# Altium project CRD25DA12N-FMC V1-2 (01-2024).PrjPcb (part 4 of 8)
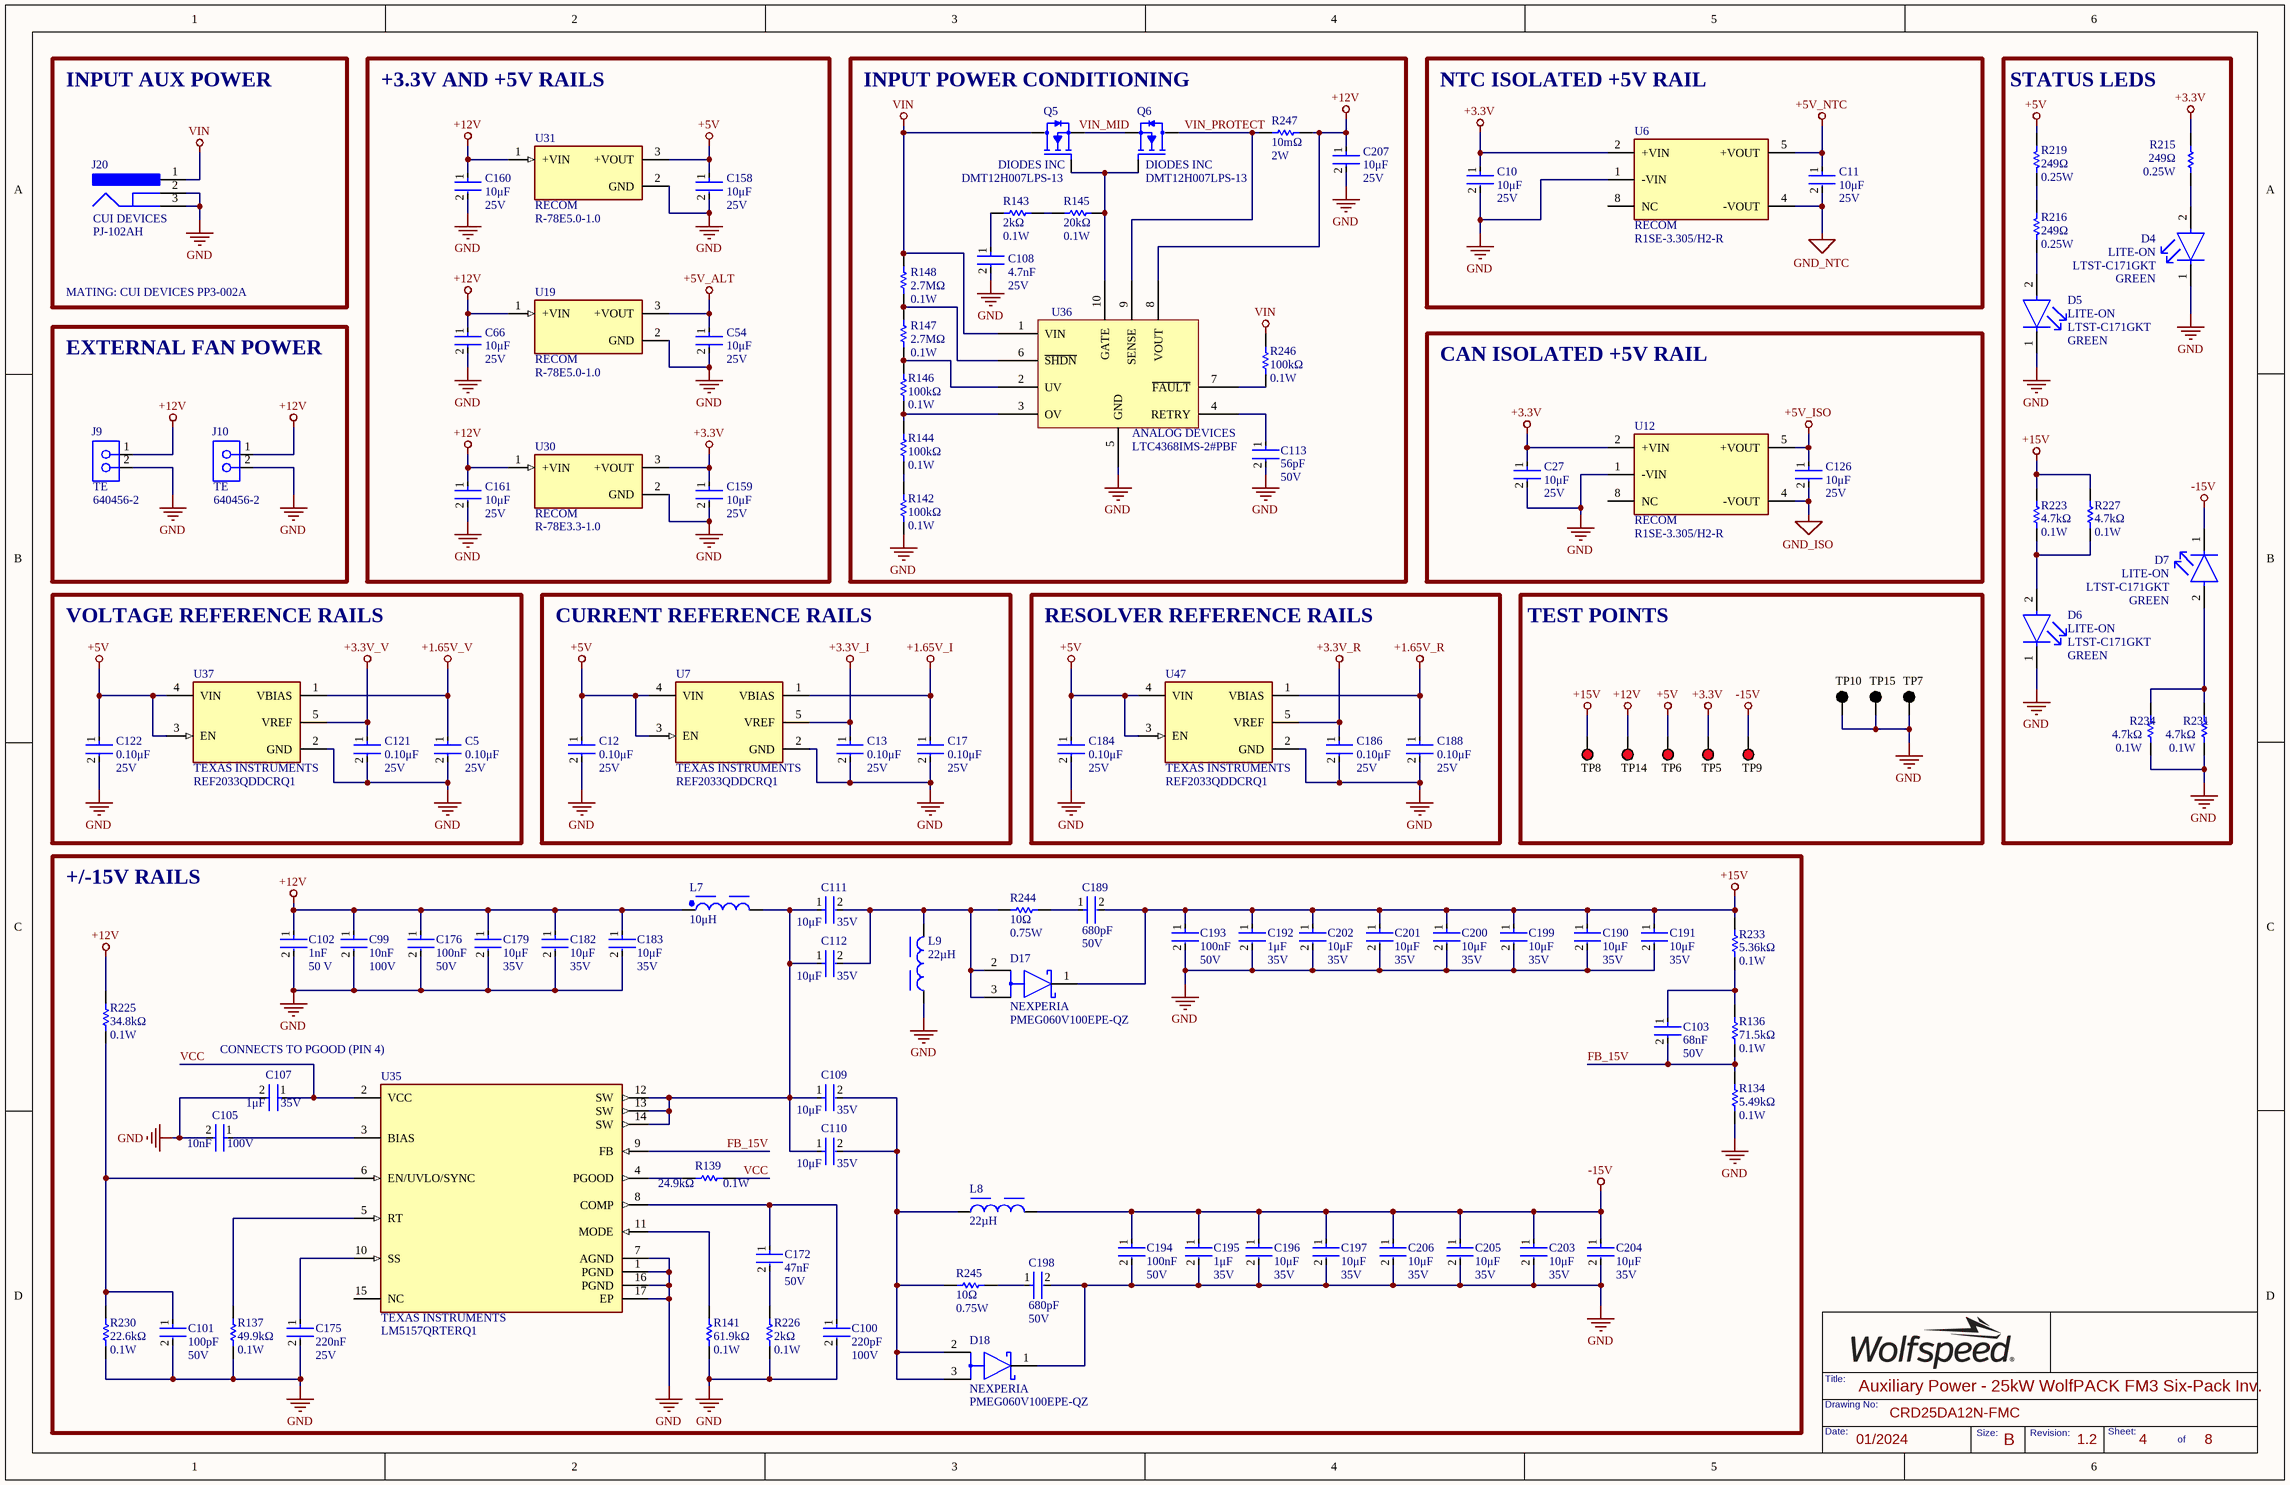
[diagram p9: 04 - Auxiliary Power.SchDoc]

## Sheet 04 - Auxiliary Power.SchDoc: Auxiliary Power - 25kW WolfPACK FM3 Six-Pack Inv. (continued)

### Library data of the parts (continued)
R233 = RT0603BRD075K36L: RES SMD 5.36KOHM 0.1% 1/10W 0603; Manufacturer: YAGEO; Temperature Coefficient: 25ppm/°C; Max Power Dissipation: 100mW; Voltage Rating: 75V; Voltage Rating (DC): 50V; Supplier 1: Digikey; Manufacturer Part Number: RT0603BRD075K36L; RoHS: Yes; Category: Chip SMD Resistors; Stock 1: 5772; Pricing 1: 1=0.13, 10=0.097, 50=0.0768, 100=0.0689, 500=0.05248, 1000=0.04637 (USD); Case/Package: 0603; Case Code (Metric): 1608; Case Code (Imperial): 0603; Min Operating Temperature: -55°C; Max Operating Temperature: 155°C; Resistance: 5.36kΩ; Tolerance: 0.1%; Packaging: Tape and Reel; Series: RT; Number of Terminations: 2; Termination: SMD/SMT; Package Quantity: 5000; Features: Moisture Resistant; Length: 0.063inch; Width: 0.031inch; Height: 0.022inch; RoHS Compliant: Yes; Lead Free: Lead Free; ComponentLink1URL: https://datasheet.ciiva.com/12706/pyu-rt-1-to-0-05-rohs-l-4-12706234.pdf?src-supplier=Mouser; ComponentLink1Description: https://datasheet.ciiva.com/12706/pyu-rt-1-to-0-05-rohs-l-4-12706234.pdf?src-supplier=Mouser; ComponentLink2URL: https://datasheet.ciiva.com/46635/pyu-rt-1-to-0-05-rohs-l-5-46635294.pdf?src-supplier=Digikey; ComponentLink2Description: https://datasheet.ciiva.com/46635/pyu-rt-1-to-0-05-rohs-l-5-46635294.pdf?src-supplier=Digikey; ComponentLink3URL: https://datasheet.ciiva.com/2586/pyu-rt-1-to-0-05-rohs-l-4-2586015.pdf?src-supplier=Digikey; ComponentLink3Description: https://datasheet.ciiva.com/2586/pyu-rt-1-to-0-05-rohs-l-4-2586015.pdf?src-supplier=Digikey; Supplier Part Number 1: YAG1697CT-ND; Package: 0603
R244 R245 = CRCW121010R0FKEAHP: RES SMD 10 OHM 1% 3/4W 1210; Manufacturer: VISHAY; Voltage Rating: 200V; Max Power Dissipation: 750mW; Temperature Coefficient: 100ppm/°C; Supplier 1: Mouser; Manufacturer Part Number: CRCW121010R0FKEAHP; RoHS: Yes; Category: Chip SMD Resistors; Stock 1: 37298; Pricing 1: 1=0.62, 10=0.237, 50=0.237, 100=0.203, 500=0.15, 1000=0.133, 5000=0.104, 10000=0.103, 50000=0.09 (USD); Case/Package: 1210; Weight: 0.000564oz; Case Code (Metric): 3225; Case Code (Imperial): 1210; Contact Plating: Tin; Min Operating Temperature: -55°C; Max Operating Temperature: 155°C; Packaging: Tape and Reel; Package Quantity: 10; Resistance: 10Ω; Tolerance: 1%; Number of Terminations: 2; Termination: SMD/SMT; Features: Automotive AEC-Q200; Series: CRCW-HP; Construction: Rectangular; Voltage Rating (DC): 200V; Length: 3.2mm; Width: 0.098inch; Height: 0.028inch; Depth: 2.5mm; Ratings: AEC-Q200; Military Standard: Not; Lead Free: Lead Free; RoHS Compliant: Yes; ComponentLink1URL: https://datasheet.ciiva.com/2478/crcwhpe3-2478099.pdf?src-supplier=Digikey; ComponentLink1Description: https://datasheet.ciiva.com/2478/crcwhpe3-2478099.pdf?src-supplier=Digikey; ComponentLink2URL: https://datasheet.ciiva.com/2478/crcwhpe3-2478100.pdf?src-supplier=Digikey; ComponentLink2Description: https://datasheet.ciiva.com/2478/crcwhpe3-2478100.pdf?src-supplier=Digikey; ComponentLink3URL: https://datasheet.ciiva.com/2478/crcwhpe3-2478101.pdf?src-supplier=Digikey; ComponentLink3Description: https://datasheet.ciiva.com/2478/crcwhpe3-2478101.pdf?src-supplier=Digikey; ComponentLink4URL: https://datasheet.ciiva.com/5544/crcwhpe3-46056-5544330.pdf?src-supplier=Mouser; ComponentLink4Description: https://datasheet.ciiva.com/5544/crcwhpe3-46056-5544330.pdf?src-supplier=Mouser; Supplier Part Number 1: 71-CRCW121010R0FKEAH; Package: 1210
R247 = PE2512FKE7W0R01L: RES 0.01 OHM 1% 2W 2512; Manufacturer: YAGEO; Temperature Coefficient: 50ppm/°C; Value: 10mΩ; Supplier 1: Rs; Manufacturer Part Number: PE2512FKE7W0R01L; RoHS: Yes; Category: Chip SMD Resistors; Stock 1: 2110; Package: 2512; Case Code (Metric): 6432; Case Code (Imperial): 2512; Min Operating Temperature: -55°C; Max Operating Temperature: 170°C; Packaging: Tape and Reel; Resistor Type: Metal Film; Number of Terminations: 2; Tolerance: 1%; Features: Moisture Resistant,Automotive AEC-Q200; Length: 0.248inch; Width: 0.122inch; Height: 0.03inch; Lead Free: Lead Free; ComponentLink1URL: http://www.mouser.com/ds/2/447/PYu-PE_521_RoHS_L_1-536447.pdf?src-supplier=Mouser; ComponentLink1Description: http://www.mouser.com/ds/2/447/PYu-PE_521_RoHS_L_1-536447.pdf?src-supplier=Mouser; ComponentLink2URL: http://www.yageo.com/NewPortal/yageodocoutput?fileName=/pdf/R-Chip/PYu-PE_521_RoHS_L_5.pdf&src-supplier=Digi-Key; ComponentLink2Description: http://www.yageo.com/NewPortal/yageodocoutput?fileName=/pdf/R-Chip/PYu-PE_521_RoHS_L_5.pdf&src-supplier=Digi-Key; Supplier Part Number 1: 1995902P
TP5 TP6 TP8 TP9 TP14 = CMP-1672-00002-4: PC TEST POINT MULTIPURPOSE RED; Manufacturer: KEYSTONE; Contact Material: Bronze; Mounting Technology: Through Hole; RoHSCompliant: true; Pins: 1; Package Quantity: 100; ComponentLink2Description: Datasheet; Height: 8.12 mm; ComponentLink1URL: http://www.keyelco.com/; DatasheetVersion: Rev. F, 12/2013; Mount: Through Hole; PackageReference: 5010; Contact Plating: Silver; Packaging: Bulk; Colour: Red; REACH SVHC: No SVHC; PackageDescription: 1-Pin Through Hole Device, Dia 3.17 mm; ComponentLink2URL: http://www.keyelco.com/product-pdf.cfm?p=1319; ComponentLink1Description: Manufacturer URL; Manufacturer Part Number: 5010; Value: RED; Package: N/A
TP7 TP10 TP15 = CMP-1672-00003-4: PC TEST POINT MULTIPURPOSE BLACK; Manufacturer: KEYSTONE; ComponentLink2URL: http://www.keyelco.com/product-pdf.cfm?p=1320; Colour: Black; Pins: 1; REACH SVHC: No SVHC; ComponentLink1URL: http://www.keyelco.com/; PackageReference: 5011; Contact Plating: Silver; Package Quantity: 100; Packaging: Bulk; RoHSCompliant: true; Height: 8.12 mm; PackageDescription: 1-Pin Through Hole Device, Dia 3.17 mm; Mount: Through Hole; Mounting Technology: Through Hole; DatasheetVersion: Rev. F, 12/2013; ComponentLink1Description: Manufacturer URL; Contact Material: Bronze; ComponentLink2Description: Datasheet; Manufacturer Part Number: 5011; Value: BLACK; Package: N/A
U6 U12 = R1SE-3.305/H2-R: DC DC CONVERTER 5V 1W; Number of Outputs: 1; Min Input Voltage: 2.97V; Max Input Voltage: 3.63V; Max Output Current: 200mA; Isolation Voltage: 2kV; Efficiency: 75%; Supplier 1: Digi-Key; RoHS: Yes; Category: Board Mount Modules; Stock 1: 563; Pricing 1: 1=4.51000, 5=4.44600, 10=4.38300, 25=4.25800, 50=4.00760, 100=3.88240, 250=3.75720 (USD); Mount: Surface Mount; Case/Package: SMD/SMT; Weight: 1g; Min Operating Temperature: -40°C; Max Operating Temperature: 100°C; Packaging: Cut Tape; Voltage - Output 1: 5V; Min Input Voltage (DC): 2.97V; Max Input Voltage (DC): 3.63V; Max Output Power: 1W; Current - Output 1: 200mA; Max Power Dissipation: 1W; Max Output Voltage: 5V; Series: ECONOLINE R1SE-H2 (1W); Length: 12.75mm; Width: 10.7mm; Height: 6.7mm; Depth: 12.75mm; Reach SVHC Compliant: Yes; Lead Free: Lead Free; RoHS Compliant: Yes; ComponentLink1URL: http://www.farnell.com/datasheets/1905443.pdf?src-supplier=Farnell; ComponentLink1Description: http://www.farnell.com/datasheets/1905443.pdf?src-supplier=Farnell; ComponentLink2URL: http://www.alliedelec.com/images/products/datasheets/bm/1_Datasheets/70595177.pdf?src-supplier=Allied+Electronics; ComponentLink2Description: http://www.alliedelec.com/images/products/datasheets/bm/1_Datasheets/70595177.pdf?src-supplier=Allied+Electronics; ComponentLink3URL: https://www.recom-power.com/pdf/Econoline/R1SE_H2.pdf?src-supplier=Digi-Key; ComponentLink3Description: https://www.recom-power.com/pdf/Econoline/R1SE_H2.pdf?src-supplier=Digi-Key; ComponentLink4URL: http://www.farnell.com/datasheets/1905443.pdf?src-supplier=Element14; ComponentLink4Description: http://www.farnell.com/datasheets/1905443.pdf?src-supplier=Element14; Supplier Part Number 1: 945-R1SE-3.305/H2-RCT-ND; Value: N/A; Package: 8-SMD; Manufacturer Part Number: R1SE-3.305/H2-R
U7 U37 U47 = REF2033QDDCRQ1: AUTOMOTIVE LOW-DRIFT, LOW-POWER,; Supplier 1: Mouser; Manufacturer Part Number: REF2033QDDCRQ1; RoHS: No; Category: Voltage References; Stock 1: 7420; Pricing 1: 1=3.59, 10=3.23, 50=3.23, 100=2.65, 1000=2.02, 10000=1.7 (USD); Supplier Part Number 1: 595-REF2033QDDCRQ1; Package: TSOT-23-5; Value: N/A
U19 U31 = R-78E5.0-1.0: DC DC CONVERTER 5V 5W; Number of Outputs: 1; Min Input Voltage: 8V; Max Input Voltage: 28V; Max Output Current: 1A; Efficiency: 91%; Supplier 1: Rs; Manufacturer: RECOM; Manufacturer Part Number: R-78E5.0-1.0; RoHS: Yes; Category: Voltage Regulators - Switching; Stock 1: 661; Mount: Through Hole; Case/Package: SIP; Weight: 2g; Min Operating Temperature: -40°C; Max Operating Temperature: 85°C; Packaging: Rail/Tube; Voltage - Output 1: 5V; Max Power Dissipation: 5W; Output Power: 5W; Current - Output 1: 1A; Package Quantity: 42; Max Output Voltage: 5V; Features: SCP; Length: 11.6mm; Width: 8.5mm; Height: 10.4mm; Lead Free: Lead Free; RoHS Compliant: Yes; ComponentLink1URL: http://www.farnell.com/datasheets/2787646.pdf?src-supplier=Farnell; ComponentLink1Description: http://www.farnell.com/datasheets/2787646.pdf?src-supplier=Farnell; ComponentLink2URL: http://www.mouser.com/ds/2/468/R-78Exx-1.0-958279.pdf?src-supplier=Mouser; ComponentLink2Description: http://www.mouser.com/ds/2/468/R-78Exx-1.0-958279.pdf?src-supplier=Mouser; ComponentLink3URL: https://www.recom-power.com/pdf/Innoline/R-78Exx-1.0.pdf?src-supplier=Digi-Key; ComponentLink3Description: https://www.recom-power.com/pdf/Innoline/R-78Exx-1.0.pdf?src-supplier=Digi-Key; ComponentLink4URL: http://www.farnell.com/datasheets/1848475.pdf?src-supplier=Newark; ComponentLink4Description: http://www.farnell.com/datasheets/1848475.pdf?src-supplier=Newark; ComponentLink5URL: http://www.farnell.com/datasheets/2787646.pdf?src-supplier=Element14; ComponentLink5Description: http://www.farnell.com/datasheets/2787646.pdf?src-supplier=Element14; ComponentLink6URL: http://datasheet.octopart.com/R-78E5.0-1.0-Recom-Power-datasheet-68298118.pdf?src-supplier=Rs; ComponentLink6Description: http://datasheet.octopart.com/R-78E5.0-1.0-Recom-Power-datasheet-68298118.pdf?src-supplier=Rs; Supplier Part Number 1: 1446013; Package: 3-SIP; Value: N/A
U30 = R-78E3.3-1.0: DC DC CONVERTER 3.3V 3W; Number of Outputs: 1; Min Input Voltage: 8V; Max Input Voltage: 28V; Max Output Current: 1A; Efficiency: 91%; Max Output Power: 3.3W; Min Input Voltage (DC): 7V; Supplier 1: Rs; Manufacturer: RECOM; Manufacturer Part Number: R-78E3.3-1.0; RoHS: Yes; Category: Board Mount Modules; Stock 1: 1; Pricing 1: 1=3.93700, 5=3.82200, 10=3.69700, 25=3.58300, 50=3.46900 (USD); Mount: Through Hole; Case/Package: SIP; Weight: 2g; Min Operating Temperature: -40°C; Max Operating Temperature: 85°C; Packaging: Rail/Tube; Voltage - Output 1: 3.3V; Nominal Output Voltage: 3.3V; Max Input Voltage (DC): 28V; Max Power Dissipation: 3W; Max Output Voltage: 3.3V; Features: SCP; Series: INNOLINE R-78E; Length: 11.6mm; Width: 8.5mm; Height: 10.4mm; Reach SVHC Compliant: Yes; Lead Free: Lead Free; RoHS Compliant: Yes; ComponentLink1URL: http://www.farnell.com/datasheets/2787646.pdf?src-supplier=Farnell; ComponentLink1Description: http://www.farnell.com/datasheets/2787646.pdf?src-supplier=Farnell; ComponentLink2URL: https://www.recom-power.com/pdf/Innoline/R-78Exx-1.0.pdf?src-supplier=Digi-Key; ComponentLink2Description: https://www.recom-power.com/pdf/Innoline/R-78Exx-1.0.pdf?src-supplier=Digi-Key; ComponentLink3URL: http://www.farnell.com/datasheets/1965125.pdf?src-supplier=Element14; ComponentLink3Description: http://www.farnell.com/datasheets/1965125.pdf?src-supplier=Element14; ComponentLink4URL: http://www.farnell.com/datasheets/2787646.pdf?src-supplier=Newark; ComponentLink4Description: http://www.farnell.com/datasheets/2787646.pdf?src-supplier=Newark; Supplier Part Number 1: 9176626; Package: 3-SIP; Value: N/A
U35 = LM5157QRTERQ1: IC REG MULT CONFG ADJ 6.5A 16QFN; Supplier 1: Mouser; RoHS: No; Category: Voltage Regulators - Switching; Stock 1: 10233; Pricing 1: 1=4.45, 10=3.79, 50=3.79, 100=3.28, 250=3.11, 500=2.79, 1000=2.36, 3000=2.29, 10000=2.29 (USD); RoHS Compliant: Yes; Case/Package: 16-WFQFN; Value: N/A; Supplier Part Number 1: 595-LM5157QRTERQ1; Manufacturer Part Number: LM5157QRTERQ1; Package: 16-WFQFN
U36 = LTC4368IMS-2#PBF: IC SURGE SUPPRESSION ADJ 10MSOP; Supplier 1: Digi-Key; Manufacturer: ANALOG DEVICES; Manufacturer Part Number: LTC4368IMS-2#PBF; RoHS: Yes; Category: Power Management ICs; Pricing 1: 1=6.69000, 10=6.03900, 25=5.75840, 100=5.00000, 250=4.77528, 500=4.35396, 1000=3.97500 (USD); ComponentLink1URL: http://www.linear.com/docs/57622?src-supplier=Digi-Key; ComponentLink1Description: http://www.linear.com/docs/57622?src-supplier=Digi-Key; Supplier Part Number 1: 505-LTC4368IMS-2#PBF-ND; Package: 10-MSOP; Value: N/A

## Sheet 05 - Gate Drivers.SchDoc: Gate Drivers - 25kW WolfPACK FM3 Six-Pack Inv.
size 431 x 279 mm; Date: 01/2024; DocumentNumber: CRD25DA12N-FMC; Revision: 1.2; SheetNumber: 5; SheetTotal: 8; SheetSize: B
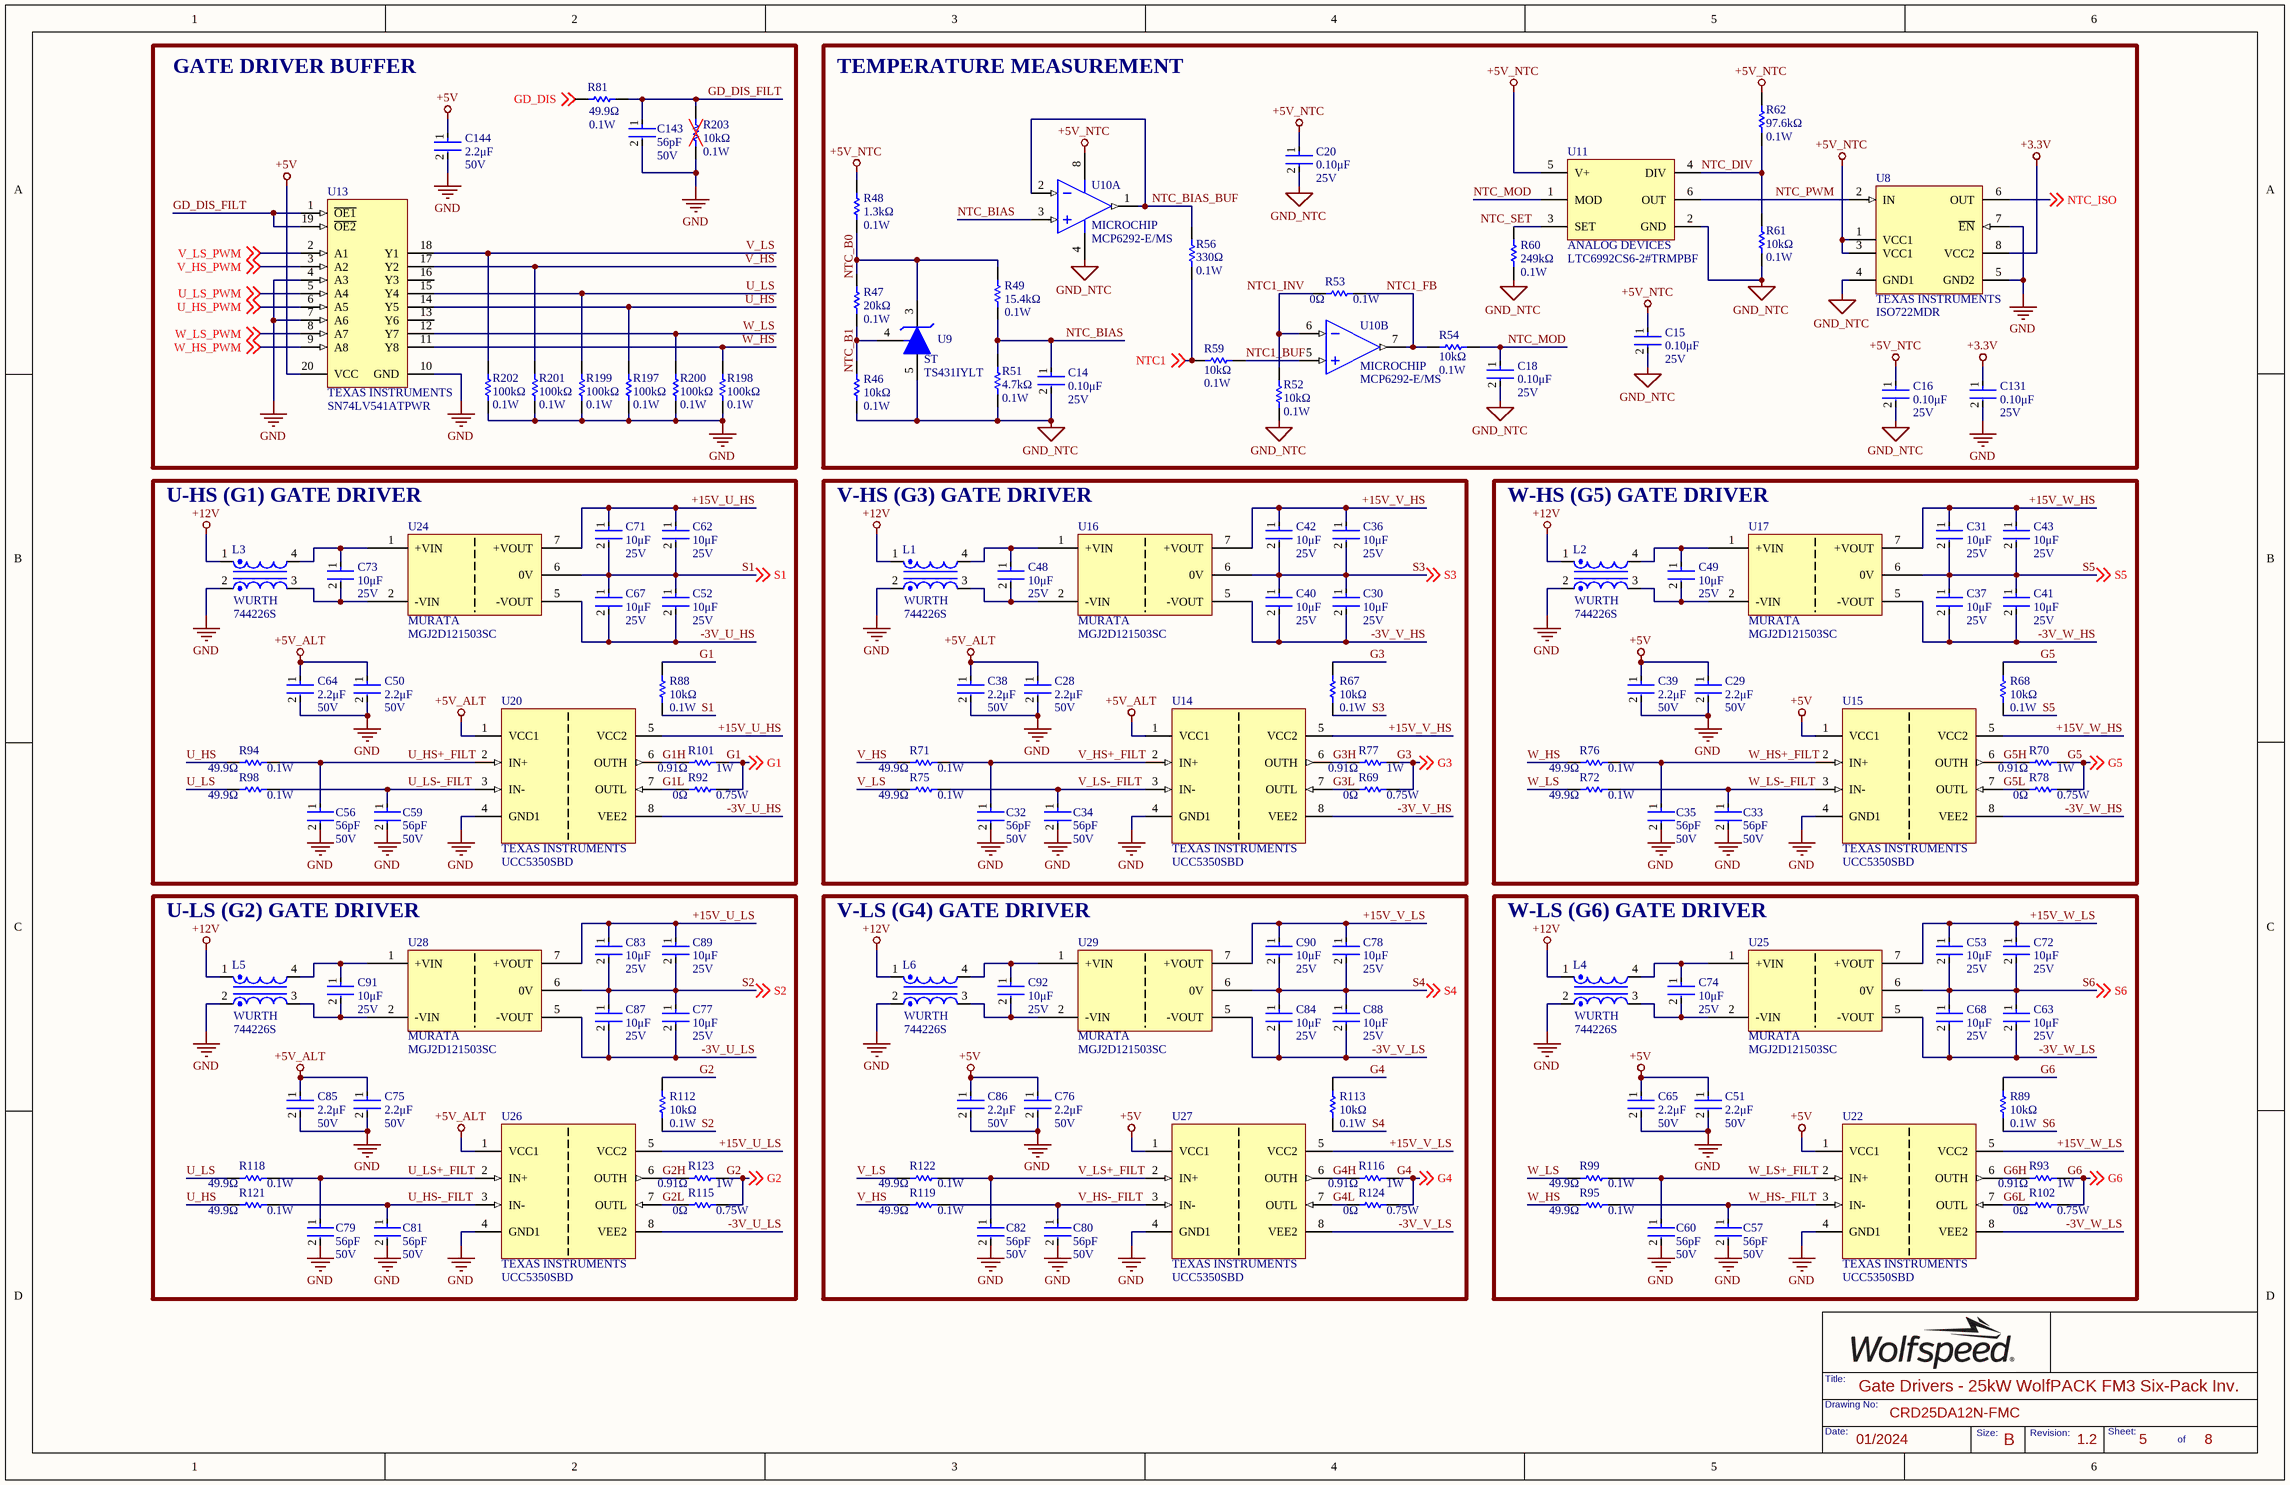
[diagram p4: 05 - Gate Drivers.SchDoc]

### Parts
C14  Voltage Rating: 25V  Capacitance: 0.10μF  [FP-C0603C-CF-IPC_B]  (hidden comment: C0603C104K3RACTU)
C15  Voltage Rating: 25V  Capacitance: 0.10μF  [FP-C0603C-CF-IPC_B]  (hidden comment: C0603C104K3RACTU)
C16  Voltage Rating: 25V  Capacitance: 0.10μF  [FP-C0603C-CF-IPC_B]  (hidden comment: C0603C104K3RACTU)
C18  Voltage Rating: 25V  Capacitance: 0.10μF  [FP-C0603C-CF-IPC_B]  (hidden comment: C0603C104K3RACTU)
C20  Voltage Rating: 25V  Capacitance: 0.10μF  [FP-C0603C-CF-IPC_B]  (hidden comment: C0603C104K3RACTU)
C28  Voltage Rating: 50V  Capacitance: 2.2μF  [FP-C0603C-CF-IPC_B]  (hidden comment: GRT188R61H225ME13D)
C29  Voltage Rating: 50V  Capacitance: 2.2μF  [FP-C0603C-CF-IPC_B]  (hidden comment: GRT188R61H225ME13D)
C30  Voltage Rating: 25V  Capacitance: 10μF  [FP-CL31-IPC_B]  (hidden comment: CL31B106KAHSFNE)
C31  Voltage Rating: 25V  Capacitance: 10μF  [FP-CL31-IPC_B]  (hidden comment: CL31B106KAHSFNE)
C32  Capacitance: 56pF  Voltage Rating: 50V  [FP-C0603C-CF-IPC_B]  (hidden comment: CL10C560JB8NNNC)
C33  Capacitance: 56pF  Voltage Rating: 50V  [FP-C0603C-CF-IPC_B]  (hidden comment: CL10C560JB8NNNC)
C34  Capacitance: 56pF  Voltage Rating: 50V  [FP-C0603C-CF-IPC_B]  (hidden comment: CL10C560JB8NNNC)
C35  Capacitance: 56pF  Voltage Rating: 50V  [FP-C0603C-CF-IPC_B]  (hidden comment: CL10C560JB8NNNC)
C36  Voltage Rating: 25V  Capacitance: 10μF  [FP-CL31-IPC_B]  (hidden comment: CL31B106KAHSFNE)
C37  Voltage Rating: 25V  Capacitance: 10μF  [FP-CL31-IPC_B]  (hidden comment: CL31B106KAHSFNE)
C38  Voltage Rating: 50V  Capacitance: 2.2μF  [FP-C0603C-CF-IPC_B]  (hidden comment: GRT188R61H225ME13D)
C39  Voltage Rating: 50V  Capacitance: 2.2μF  [FP-C0603C-CF-IPC_B]  (hidden comment: GRT188R61H225ME13D)
C40  Voltage Rating: 25V  Capacitance: 10μF  [FP-CL31-IPC_B]  (hidden comment: CL31B106KAHSFNE)
C41  Voltage Rating: 25V  Capacitance: 10μF  [FP-CL31-IPC_B]  (hidden comment: CL31B106KAHSFNE)
C42  Voltage Rating: 25V  Capacitance: 10μF  [FP-CL31-IPC_B]  (hidden comment: CL31B106KAHSFNE)
C43  Voltage Rating: 25V  Capacitance: 10μF  [FP-CL31-IPC_B]  (hidden comment: CL31B106KAHSFNE)
C48  Voltage Rating: 25V  Capacitance: 10μF  [FP-CL31-IPC_B]  (hidden comment: CL31B106KAHSFNE)
C49  Voltage Rating: 25V  Capacitance: 10μF  [FP-CL31-IPC_B]  (hidden comment: CL31B106KAHSFNE)
C50  Voltage Rating: 50V  Capacitance: 2.2μF  [FP-C0603C-CF-IPC_B]  (hidden comment: GRT188R61H225ME13D)
C51  Voltage Rating: 50V  Capacitance: 2.2μF  [FP-C0603C-CF-IPC_B]  (hidden comment: GRT188R61H225ME13D)
C52  Voltage Rating: 25V  Capacitance: 10μF  [FP-CL31-IPC_B]  (hidden comment: CL31B106KAHSFNE)
C53  Voltage Rating: 25V  Capacitance: 10μF  [FP-CL31-IPC_B]  (hidden comment: CL31B106KAHSFNE)
C56  Capacitance: 56pF  Voltage Rating: 50V  [FP-C0603C-CF-IPC_B]  (hidden comment: CL10C560JB8NNNC)
C57  Capacitance: 56pF  Voltage Rating: 50V  [FP-C0603C-CF-IPC_B]  (hidden comment: CL10C560JB8NNNC)
C59  Capacitance: 56pF  Voltage Rating: 50V  [FP-C0603C-CF-IPC_B]  (hidden comment: CL10C560JB8NNNC)
C60  Capacitance: 56pF  Voltage Rating: 50V  [FP-C0603C-CF-IPC_B]  (hidden comment: CL10C560JB8NNNC)
C62  Voltage Rating: 25V  Capacitance: 10μF  [FP-CL31-IPC_B]  (hidden comment: CL31B106KAHSFNE)
C63  Voltage Rating: 25V  Capacitance: 10μF  [FP-CL31-IPC_B]  (hidden comment: CL31B106KAHSFNE)
C64  Voltage Rating: 50V  Capacitance: 2.2μF  [FP-C0603C-CF-IPC_B]  (hidden comment: GRT188R61H225ME13D)
C65  Voltage Rating: 50V  Capacitance: 2.2μF  [FP-C0603C-CF-IPC_B]  (hidden comment: GRT188R61H225ME13D)
C67  Voltage Rating: 25V  Capacitance: 10μF  [FP-CL31-IPC_B]  (hidden comment: CL31B106KAHSFNE)
C68  Voltage Rating: 25V  Capacitance: 10μF  [FP-CL31-IPC_B]  (hidden comment: CL31B106KAHSFNE)
C71  Voltage Rating: 25V  Capacitance: 10μF  [FP-CL31-IPC_B]  (hidden comment: CL31B106KAHSFNE)
C72  Voltage Rating: 25V  Capacitance: 10μF  [FP-CL31-IPC_B]  (hidden comment: CL31B106KAHSFNE)
C73  Voltage Rating: 25V  Capacitance: 10μF  [FP-CL31-IPC_B]  (hidden comment: CL31B106KAHSFNE)
C74  Voltage Rating: 25V  Capacitance: 10μF  [FP-CL31-IPC_B]  (hidden comment: CL31B106KAHSFNE)
C75  Voltage Rating: 50V  Capacitance: 2.2μF  [FP-C0603C-CF-IPC_B]  (hidden comment: GRT188R61H225ME13D)
C76  Voltage Rating: 50V  Capacitance: 2.2μF  [FP-C0603C-CF-IPC_B]  (hidden comment: GRT188R61H225ME13D)
C77  Voltage Rating: 25V  Capacitance: 10μF  [FP-CL31-IPC_B]  (hidden comment: CL31B106KAHSFNE)
C78  Voltage Rating: 25V  Capacitance: 10μF  [FP-CL31-IPC_B]  (hidden comment: CL31B106KAHSFNE)
C79  Capacitance: 56pF  Voltage Rating: 50V  [FP-C0603C-CF-IPC_B]  (hidden comment: CL10C560JB8NNNC)
C80  Capacitance: 56pF  Voltage Rating: 50V  [FP-C0603C-CF-IPC_B]  (hidden comment: CL10C560JB8NNNC)
C81  Capacitance: 56pF  Voltage Rating: 50V  [FP-C0603C-CF-IPC_B]  (hidden comment: CL10C560JB8NNNC)
C82  Capacitance: 56pF  Voltage Rating: 50V  [FP-C0603C-CF-IPC_B]  (hidden comment: CL10C560JB8NNNC)
C83  Voltage Rating: 25V  Capacitance: 10μF  [FP-CL31-IPC_B]  (hidden comment: CL31B106KAHSFNE)
C84  Voltage Rating: 25V  Capacitance: 10μF  [FP-CL31-IPC_B]  (hidden comment: CL31B106KAHSFNE)
C85  Voltage Rating: 50V  Capacitance: 2.2μF  [FP-C0603C-CF-IPC_B]  (hidden comment: GRT188R61H225ME13D)
C86  Voltage Rating: 50V  Capacitance: 2.2μF  [FP-C0603C-CF-IPC_B]  (hidden comment: GRT188R61H225ME13D)
C87  Voltage Rating: 25V  Capacitance: 10μF  [FP-CL31-IPC_B]  (hidden comment: CL31B106KAHSFNE)
C88  Voltage Rating: 25V  Capacitance: 10μF  [FP-CL31-IPC_B]  (hidden comment: CL31B106KAHSFNE)
C89  Voltage Rating: 25V  Capacitance: 10μF  [FP-CL31-IPC_B]  (hidden comment: CL31B106KAHSFNE)
C90  Voltage Rating: 25V  Capacitance: 10μF  [FP-CL31-IPC_B]  (hidden comment: CL31B106KAHSFNE)
C91  Voltage Rating: 25V  Capacitance: 10μF  [FP-CL31-IPC_B]  (hidden comment: CL31B106KAHSFNE)
C92  Voltage Rating: 25V  Capacitance: 10μF  [FP-CL31-IPC_B]  (hidden comment: CL31B106KAHSFNE)
C131  Voltage Rating: 25V  Capacitance: 0.10μF  [FP-C0603C-CF-IPC_B]  (hidden comment: C0603C104K3RACTU)
C143  Capacitance: 56pF  Voltage Rating: 50V  [FP-C0603C-CF-IPC_B]  (hidden comment: CL10C560JB8NNNC)
C144  Voltage Rating: 50V  Capacitance: 2.2μF  [FP-C0603C-CF-IPC_B]  (hidden comment: GRT188R61H225ME13D)
L1  744226S  Manufacturer Print: WURTH  [WE-SL2]
L2  744226S  Manufacturer Print: WURTH  [WE-SL2]
L3  744226S  Manufacturer Print: WURTH  [WE-SL2]
L4  744226S  Manufacturer Print: WURTH  [WE-SL2]
L5  744226S  Manufacturer Print: WURTH  [WE-SL2]
L6  744226S  Manufacturer Print: WURTH  [WE-SL2]
R46  Resistance: 10kΩ  Max Power Dissipation: 0.1W  [FP-MCR03-IPC_B]  (hidden comment: ERJ3EKF1002V)
R47  Resistance: 20kΩ  Power Rating: 0.1W  [FP-MCR03-IPC_B]  (hidden comment: CRCW060320K0FKTA)
R48  Power Rating: 0.1W  Resistance: 1.3kΩ  [FP-MCR03-IPC_B]  (hidden comment: ERA3AEB132V)
R49  Power Rating: 0.1W  Resistance: 15.4kΩ  [FP-MCR03-IPC_B]  (hidden comment: RC1608F1542CS)
R51  Resistance: 4.7kΩ  Power Rating: 0.1W  [FP-MCR03-IPC_B]  (hidden comment: CRCW06034K70FKTA)
R52  Resistance: 10kΩ  Max Power Dissipation: 0.1W  [FP-MCR03-IPC_B]  (hidden comment: ERJ3EKF1002V)
R53  Resistance: 0Ω  Power Rating: 0.1W  [FP-MCR03-IPC_B]  (hidden comment: CRCW06030000Z0EB)
R54  Resistance: 10kΩ  Max Power Dissipation: 0.1W  [FP-MCR03-IPC_B]  (hidden comment: ERJ3EKF1002V)
R56  Resistance: 330Ω  Power Rating: 0.1W  [FP-MCR03-IPC_B]  (hidden comment: RC0603FR-13330RL)
R59  Resistance: 10kΩ  Max Power Dissipation: 0.1W  [FP-MCR03-IPC_B]  (hidden comment: ERJ3EKF1002V)
R60  Max Power Dissipation: 0.1W  Resistance: 249kΩ  [FP-MCR03-IPC_B]  (hidden comment: RMCF0603FT249K)
R61  Resistance: 10kΩ  Max Power Dissipation: 0.1W  [FP-MCR03-IPC_B]  (hidden comment: ERJ3EKF1002V)
R62  Resistance: 97.6kΩ  Max Power Dissipation: 0.1W  [FP-MCR03-IPC_B]  (hidden comment: ERJ-3EKF9762V)
R67  Resistance: 10kΩ  Max Power Dissipation: 0.1W  [FP-MCR03-IPC_B]  (hidden comment: ERJ3EKF1002V)
R68  Resistance: 10kΩ  Max Power Dissipation: 0.1W  [FP-MCR03-IPC_B]  (hidden comment: ERJ3EKF1002V)
R69  value 0Ω  Power Rating: 0.75W  [RESC3125X70X40NL20T20]  (hidden comment: CRCW12100000Z0EAHP)
R70  value 0.91Ω  Power: 1W  [RESC3125X70X40NL20T20]  (hidden comment: RCWE1210R910FKEA)
R71  Resistance: 49.9Ω  Power Rating: 0.1W  [FP-MCR03-IPC_B]  (hidden comment: ERJ-3EKF49R9V)
R72  Resistance: 49.9Ω  Power Rating: 0.1W  [FP-MCR03-IPC_B]  (hidden comment: ERJ-3EKF49R9V)
R75  Resistance: 49.9Ω  Power Rating: 0.1W  [FP-MCR03-IPC_B]  (hidden comment: ERJ-3EKF49R9V)
R76  Resistance: 49.9Ω  Power Rating: 0.1W  [FP-MCR03-IPC_B]  (hidden comment: ERJ-3EKF49R9V)
R77  value 0.91Ω  Power: 1W  [RESC3125X70X40NL20T20]  (hidden comment: RCWE1210R910FKEA)
R78  value 0Ω  Power Rating: 0.75W  [RESC3125X70X40NL20T20]  (hidden comment: CRCW12100000Z0EAHP)
R81  Resistance: 49.9Ω  Power Rating: 0.1W  [FP-MCR03-IPC_B]  (hidden comment: ERJ-3EKF49R9V)
R88  Resistance: 10kΩ  Max Power Dissipation: 0.1W  [FP-MCR03-IPC_B]  (hidden comment: ERJ3EKF1002V)
R89  Resistance: 10kΩ  Max Power Dissipation: 0.1W  [FP-MCR03-IPC_B]  (hidden comment: ERJ3EKF1002V)
R92  value 0Ω  Power Rating: 0.75W  [RESC3125X70X40NL20T20]  (hidden comment: CRCW12100000Z0EAHP)
R93  value 0.91Ω  Power: 1W  [RESC3125X70X40NL20T20]  (hidden comment: RCWE1210R910FKEA)
R94  Resistance: 49.9Ω  Power Rating: 0.1W  [FP-MCR03-IPC_B]  (hidden comment: ERJ-3EKF49R9V)
R95  Resistance: 49.9Ω  Power Rating: 0.1W  [FP-MCR03-IPC_B]  (hidden comment: ERJ-3EKF49R9V)
R98  Resistance: 49.9Ω  Power Rating: 0.1W  [FP-MCR03-IPC_B]  (hidden comment: ERJ-3EKF49R9V)
R99  Resistance: 49.9Ω  Power Rating: 0.1W  [FP-MCR03-IPC_B]  (hidden comment: ERJ-3EKF49R9V)
R101  value 0.91Ω  Power: 1W  [RESC3125X70X40NL20T20]  (hidden comment: RCWE1210R910FKEA)
R102  value 0Ω  Power Rating: 0.75W  [RESC3125X70X40NL20T20]  (hidden comment: CRCW12100000Z0EAHP)
R112  Resistance: 10kΩ  Max Power Dissipation: 0.1W  [FP-MCR03-IPC_B]  (hidden comment: ERJ3EKF1002V)
R113  Resistance: 10kΩ  Max Power Dissipation: 0.1W  [FP-MCR03-IPC_B]  (hidden comment: ERJ3EKF1002V)
R115  value 0Ω  Power Rating: 0.75W  [RESC3125X70X40NL20T20]  (hidden comment: CRCW12100000Z0EAHP)
R116  value 0.91Ω  Power: 1W  [RESC3125X70X40NL20T20]  (hidden comment: RCWE1210R910FKEA)
R118  Resistance: 49.9Ω  Power Rating: 0.1W  [FP-MCR03-IPC_B]  (hidden comment: ERJ-3EKF49R9V)
R119  Resistance: 49.9Ω  Power Rating: 0.1W  [FP-MCR03-IPC_B]  (hidden comment: ERJ-3EKF49R9V)
R121  Resistance: 49.9Ω  Power Rating: 0.1W  [FP-MCR03-IPC_B]  (hidden comment: ERJ-3EKF49R9V)
R122  Resistance: 49.9Ω  Power Rating: 0.1W  [FP-MCR03-IPC_B]  (hidden comment: ERJ-3EKF49R9V)
R123  value 0.91Ω  Power: 1W  [RESC3125X70X40NL20T20]  (hidden comment: RCWE1210R910FKEA)
R124  value 0Ω  Power Rating: 0.75W  [RESC3125X70X40NL20T20]  (hidden comment: CRCW12100000Z0EAHP)
R197  Resistance: 100kΩ  Power Rating: 0.1W  [FP-MCR03-IPC_B]  (hidden comment: RC0603FR-07100KL)
R198  Resistance: 100kΩ  Power Rating: 0.1W  [FP-MCR03-IPC_B]  (hidden comment: RC0603FR-07100KL)
R199  Resistance: 100kΩ  Power Rating: 0.1W  [FP-MCR03-IPC_B]  (hidden comment: RC0603FR-07100KL)
R200  Resistance: 100kΩ  Power Rating: 0.1W  [FP-MCR03-IPC_B]  (hidden comment: RC0603FR-07100KL)
R201  Resistance: 100kΩ  Power Rating: 0.1W  [FP-MCR03-IPC_B]  (hidden comment: RC0603FR-07100KL)
R202  Resistance: 100kΩ  Power Rating: 0.1W  [FP-MCR03-IPC_B]  (hidden comment: RC0603FR-07100KL)
R203  Resistance: 10kΩ  Max Power Dissipation: 0.1W  [FP-MCR03-IPC_B]  (hidden comment: ERJ3EKF1002V)
U8  ISO722MDR  Manufacturer: TEXAS INSTRUMENTS  [D0008B_L]
U9  TS431IYLT  Manufacturer Print: ST  [SOT95P280X145-5N]
U10  MCP6292-E/MS  Manufacturer Print: MICROCHIP  [MSOP-MS8_L]  (parts A,B of 2)
U11  LTC6992CS6-2#TRMPBF  MANUFACTURER PRINT: ANALOG DEVICES  [SOT95P280X100-6N]
U13  Manufacturer: TEXAS INSTRUMENTS  [PW0020A_L]  (hidden comment: SN74LV541ATPWR)
U14  UCC5350SBD  Manufacturer Print: TEXAS INSTRUMENTS  [D0008B_HV]
U15  UCC5350SBD  Manufacturer Print: TEXAS INSTRUMENTS  [D0008B_HV]
U16  MGJ2D121503SC  Manufacturer Print: MURATA  [MGJ2D121509SC]
U17  MGJ2D121503SC  Manufacturer Print: MURATA  [MGJ2D121509SC]
U20  UCC5350SBD  Manufacturer Print: TEXAS INSTRUMENTS  [D0008B_HV]
U22  UCC5350SBD  Manufacturer Print: TEXAS INSTRUMENTS  [D0008B_HV]
U24  MGJ2D121503SC  Manufacturer Print: MURATA  [MGJ2D121509SC]
U25  MGJ2D121503SC  Manufacturer Print: MURATA  [MGJ2D121509SC]
U26  UCC5350SBD  Manufacturer Print: TEXAS INSTRUMENTS  [D0008B_HV]
U27  UCC5350SBD  Manufacturer Print: TEXAS INSTRUMENTS  [D0008B_HV]
U28  MGJ2D121503SC  Manufacturer Print: MURATA  [MGJ2D121509SC]
U29  MGJ2D121503SC  Manufacturer Print: MURATA  [MGJ2D121509SC]

### Blocks framed on the sheet
GATE DRIVER BUFFER: C143 C144 R81 R197-R203 U13
TEMPERATURE MEASUREMENT: C14-C16 C18 C20 C131 R46-R49 R51-R54 R56 R59-R62 U8-U11
U-HS (G1) GATE DRIVER: C50 C52 C56 C59 C62 C64 C67 C71 C73 L3 R88 R92 R94 R98 R101 U20 U24
V-HS (G3) GATE DRIVER: C28 C30 C32 C34 C36 C38 C40 C42 C48 L1 R67 R69 R71 R75 R77 U14 U16
W-HS (G5) GATE DRIVER: C29 C31 C33 C35 C37 C39 C41 C43 C49 L2 R68 R70 R72 R76 R78 U15 U17
U-LS (G2) GATE DRIVER: C75 C77 C79 C81 C83 C85 C87 C89 C91 L5 R112 R115 R118 R121 R123 U26 U28
V-LS (G4) GATE DRIVER: C76 C78 C80 C82 C84 C86 C88 C90 C92 L6 R113 R116 R119 R122 R124 U27 U29
W-LS (G6) GATE DRIVER: C51 C53 C57 C60 C63 C65 C68 C72 C74 L4 R89 R93 R95 R99 R102 U22 U25

### Nets
+3.3V: C131.1 U8.8(VCC2)
+5V: C29.1 C39.1 C51.1 C65.1 C76.1 C86.1 C144.1 U13.20(VCC) U15.1(VCC1) U22.1(VCC1) U27.1(VCC1)
+5V_ALT: C28.1 C38.1 C50.1 C64.1 C75.1 C85.1 U14.1(VCC1) U20.1(VCC1) U26.1(VCC1)
+5V_NTC: C15.1 C16.1 C20.1 R48.2 R62.2 U8.1(VCC1) U8.3(VCC1) U10.8(VDD) U11.5(V+)
+12V: L1.1 L2.1 L3.1 L4.1 L5.1 L6.1
GND: C28.2 C29.2 C32.2 C33.2 C34.2 C35.2 C38.2 C39.2 C50.2 C51.2 C56.2 C57.2 C59.2 C60.2 C64.2 C65.2 C75.2 C76.2 C79.2 C80.2 C81.2 C82.2 C85.2 C86.2 C131.2 C143.2 C144.2 L1.2 L2.2 L3.2 L4.2 L5.2 L6.2 R197.1 R198.1 R199.1 R200.1 R201.1 R202.1 R203.1 U8.5(GND2) U8.7(~{EN}) U13.4(A3) U13.7(A6) U13.10(GND) U14.4(GND1) U15.4(GND1) U20.4(GND1) U22.4(GND1) U26.4(GND1) U27.4(GND1)
GND_NTC: C14.2 C15.2 C16.2 C18.2 C20.2 R46.1 R51.1 R52.1 R60.1 R61.1 U8.4(GND1) U9.5 U10.4(VSS) U11.2(GND)
+15V_U_HS: C62.1 C71.1 U20.5(VCC2) U24.7(+VOUT)
+15V_U_LS: C83.1 C89.1 U26.5(VCC2) U28.7(+VOUT)
+15V_V_HS: C36.1 C42.1 U14.5(VCC2) U16.7(+VOUT)
+15V_V_LS: C78.1 C90.1 U27.5(VCC2) U29.7(+VOUT)
+15V_W_HS: C31.1 C43.1 U15.5(VCC2) U17.7(+VOUT)
+15V_W_LS: C53.1 C72.1 U22.5(VCC2) U25.7(+VOUT)
-3V_U_HS: C52.2 C67.2 U20.8(VEE2) U24.5(-VOUT)
-3V_U_LS: C77.2 C87.2 U26.8(VEE2) U28.5(-VOUT)
-3V_V_HS: C30.2 C40.2 U14.8(VEE2) U16.5(-VOUT)
-3V_V_LS: C84.2 C88.2 U27.8(VEE2) U29.5(-VOUT)
-3V_W_HS: C37.2 C41.2 U15.8(VEE2) U17.5(-VOUT)
-3V_W_LS: C63.2 C68.2 U22.8(VEE2) U25.5(-VOUT)
G1: R88.2 R92.2 R101.2 ; off-sheet G1
G1H: R101.1 U20.6(OUTH)
G1L: R92.1 U20.7(OUTL)
G2: R112.2 R115.2 R123.2 ; off-sheet G2
G2H: R123.1 U26.6(OUTH)
G2L: R115.1 U26.7(OUTL)
G3: R67.2 R69.2 R77.2 ; off-sheet G3
G3H: R77.1 U14.6(OUTH)
G3L: R69.1 U14.7(OUTL)
G4: R113.2 R116.2 R124.2 ; off-sheet G4
G4H: R116.1 U27.6(OUTH)
G4L: R124.1 U27.7(OUTL)
G5: R68.2 R70.2 R78.2 ; off-sheet G5
G5H: R70.1 U15.6(OUTH)
G5L: R78.1 U15.7(OUTL)
G6: R89.2 R93.2 R102.2 ; off-sheet G6
G6H: R93.1 U22.6(OUTH)
G6L: R102.1 U22.7(OUTL)
GD_DIS: R81.1 ; off-sheet GD_DIS
GD_DIS_FILT: C143.1 R81.2 R203.2 U13.1(~{OE1}) U13.19(~{OE2})
NTC1: R56.1 R59.2 ; off-sheet NTC1
NTC1_BUF: R59.1 U10.5(VINB+)
NTC1_FB: R53.2 R54.2 U10.7(VOUTB)
NTC1_INV: R52.2 R53.1 U10.6(VINB-)
NTC_B0: R47.2 R48.1 R49.2 U9.3
NTC_B1: R46.2 R47.1 U9.4
NTC_BIAS: C14.1 R49.1 R51.2 U10.3(VINA+)
NTC_BIAS_BUF: R56.2 U10.1(VOUTA) U10.2(VINA-)
NTC_DIV: R61.2 R62.1 U11.4(DIV)
NTC_ISO: U8.6(OUT) ; off-sheet NTC_ISO
NTC_MOD: C18.1 R54.1 U11.1(MOD)
NTC_PWM: U8.2(IN) U11.6(OUT)
NTC_SET: R60.2 U11.3(SET)
S1: C52.1 C62.2 C67.1 C71.2 R88.1 U24.6(0V) ; off-sheet S1
S2: C77.1 C83.2 C87.1 C89.2 R112.1 U28.6(0V) ; off-sheet S2
S3: C30.1 C36.2 C40.1 C42.2 R67.1 U16.6(0V) ; off-sheet S3
S4: C78.2 C84.1 C88.1 C90.2 R113.1 U29.6(0V) ; off-sheet S4
S5: C31.2 C37.1 C41.1 C43.2 R68.1 U17.6(0V) ; off-sheet S5
S6: C53.2 C63.1 C68.1 C72.2 R89.1 U25.6(0V) ; off-sheet S6
U_HS: R94.1 R121.1 R197.2 U13.14(Y5)
U_HS+_FILT: C56.1 R94.2 U20.2(IN+)
U_HS-_FILT: C81.1 R121.2 U26.3(IN-)
U_HS_PWM: U13.6(A5) ; off-sheet U_HS_PWM
U_LS: R98.1 R118.1 R199.2 U13.15(Y4)
U_LS+_FILT: C79.1 R118.2 U26.2(IN+)
U_LS-_FILT: C59.1 R98.2 U20.3(IN-)
U_LS_PWM: U13.5(A4) ; off-sheet U_LS_PWM
V_HS: R71.1 R119.1 R201.2 U13.17(Y2)
V_HS+_FILT: C32.1 R71.2 U14.2(IN+)
V_HS-_FILT: C80.1 R119.2 U27.3(IN-)
V_HS_PWM: U13.3(A2) ; off-sheet V_HS_PWM
V_LS: R75.1 R122.1 R202.2 U13.18(Y1)
V_LS+_FILT: C82.1 R122.2 U27.2(IN+)
V_LS-_FILT: C34.1 R75.2 U14.3(IN-)
V_LS_PWM: U13.2(A1) ; off-sheet V_LS_PWM
W_HS: R76.1 R95.1 R198.2 U13.11(Y8)
W_HS+_FILT: C35.1 R76.2 U15.2(IN+)
W_HS-_FILT: C57.1 R95.2 U22.3(IN-)
W_HS_PWM: U13.9(A8) ; off-sheet W_HS_PWM
W_LS: R72.1 R99.1 R200.2 U13.12(Y7)
W_LS+_FILT: C60.1 R99.2 U22.2(IN+)
W_LS-_FILT: C33.1 R72.2 U15.3(IN-)
W_LS_PWM: U13.8(A7) ; off-sheet W_LS_PWM
NetC48_1: C48.1 L1.4 U16.1(+VIN)
NetC48_2: C48.2 L1.3 U16.2(-VIN)
NetC49_1: C49.1 L2.4 U17.1(+VIN)
NetC49_2: C49.2 L2.3 U17.2(-VIN)
NetC73_1: C73.1 L3.4 U24.1(+VIN)
NetC73_2: C73.2 L3.3 U24.2(-VIN)
NetC74_1: C74.1 L4.4 U25.1(+VIN)
NetC74_2: C74.2 L4.3 U25.2(-VIN)
NetC91_1: C91.1 L5.4 U28.1(+VIN)
NetC91_2: C91.2 L5.3 U28.2(-VIN)
NetC92_1: C92.1 L6.4 U29.1(+VIN)
NetC92_2: C92.2 L6.3 U29.2(-VIN)

Not connected (* = marked no-connect by the designer): U13 13(Y6) 16(Y3)

### Notes on the sheet
- Title:
- Date:
- Drawing No:
- Size:
- Revision:
- Sheet:
- of